# Altium schematic sheet SD.SchDoc
size A; DocumentNumber: 7; SheetNumber: 7; SheetTotal: 13
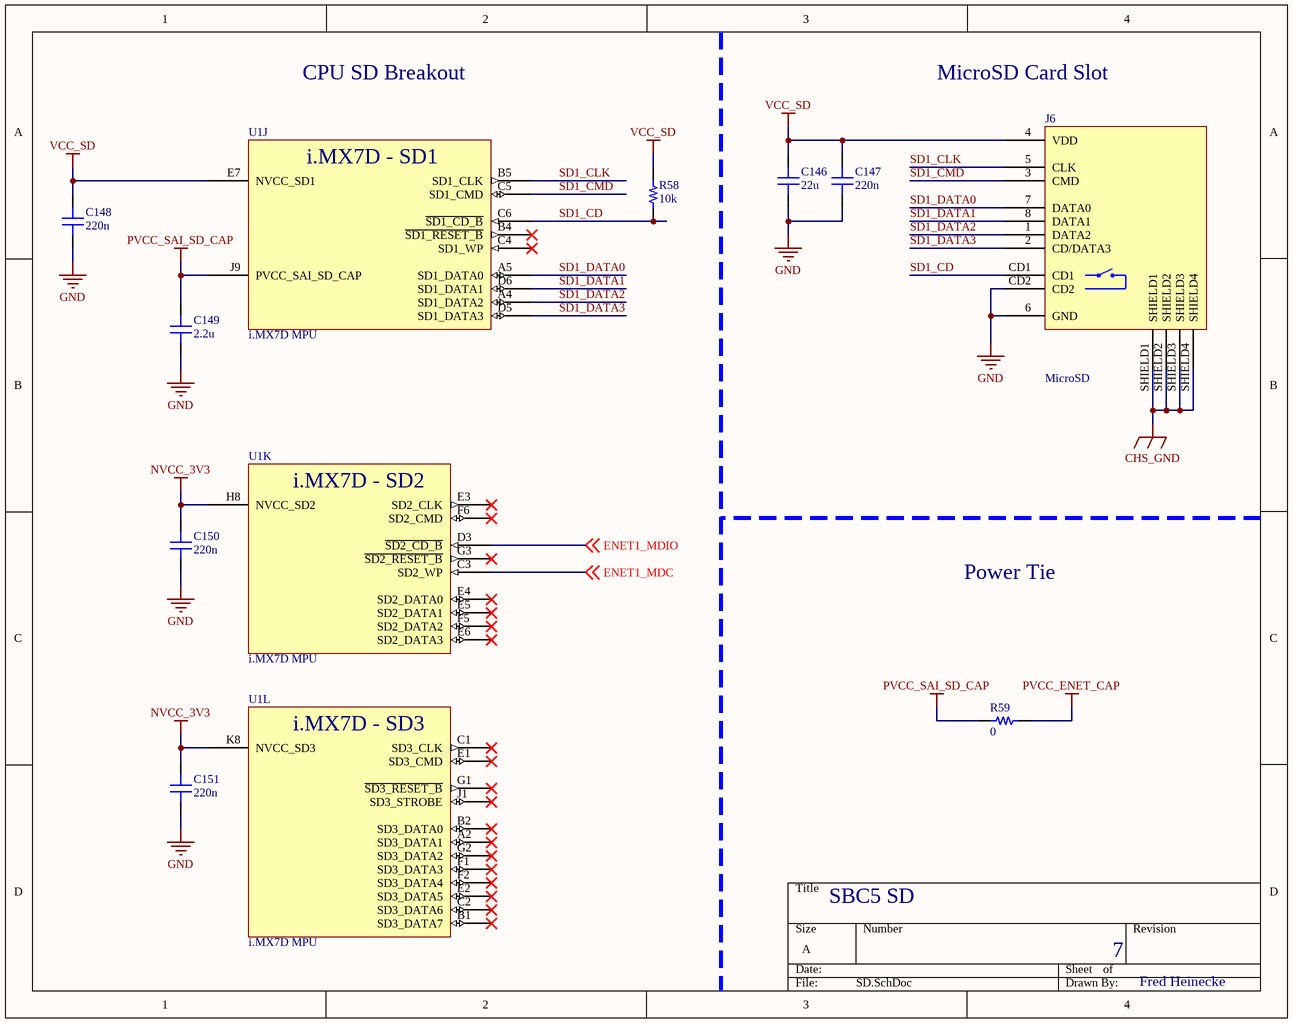
[diagram p0: SD.SchDoc]

## Parts
C146  22u  [C0603]
C147  220n  [C0201]
C148  220n  [C0201]
C149  2.2u  [C0402]
C150  220n  [C0201]
C151  220n  [C0201]
J6  MicroSD  [114-00841-68]
R58  10k  [R0201]
R59  0  [R0402]
U1  i.MX7D MPU  [BGA541C75P25X25_1900X1900X140]  (parts J,K,L of 23)

## Nets
CHS_GND: J6.SHIELD1 J6.SHIELD2 J6.SHIELD3 J6.SHIELD4
GND: C146.1 C147.1 C148.1 C149.1 C150.1 C151.1 J6.6(GND) J6.CD2
NVCC_3V3: C150.2 C151.2 U1.H8(NVCC_SD2) U1.K8(NVCC_SD3)
PVCC_ENET_CAP: R59.2
PVCC_SAI_SD_CAP: C149.2 R59.1 U1.J9(PVCC_SAI_SD_CAP)
VCC_SD: C146.2 C147.2 C148.2 J6.4(VDD) R58.2 U1.E7(NVCC_SD1)
ENET1_MDC: U1.C3(SD2_WP) ; off-sheet ENET1_MDC
ENET1_MDIO: U1.D3(~{SD2_CD_B}) ; off-sheet ENET1_MDIO
SD1_CD: J6.CD1 R58.1 U1.C6(~{SD1_CD_B})
SD1_CLK: J6.5(CLK) U1.B5(SD1_CLK)
SD1_CMD: J6.3(CMD) U1.C5(SD1_CMD)
SD1_DATA0: J6.7(DATA0) U1.A5(SD1_DATA0)
SD1_DATA1: J6.8(DATA1) U1.D6(SD1_DATA1)
SD1_DATA2: J6.1(DATA2) U1.A4(SD1_DATA2)
SD1_DATA3: J6.2(CD/DATA3) U1.D5(SD1_DATA3)

Not connected (* = marked no-connect by the designer): U1 A2(SD3_DATA1)* B1(SD3_DATA7)* B2(SD3_DATA0)* B4(~{SD1_RESET_B})* C1(SD3_CLK)* C2(SD3_DATA6)* C4(SD1_WP)* E1(SD3_CMD)* E2(SD3_DATA5)* E3(SD2_CLK)* E4(SD2_DATA0)* E5(SD2_DATA1)* E6(SD2_DATA3)* F1(SD3_DATA3)* F2(SD3_DATA4)* F5(SD2_DATA2)* F6(SD2_CMD)* G1(~{SD3_RESET_B})* G2(SD3_DATA2)* G3(~{SD2_RESET_B})* J1(SD3_STROBE)*

## Notes on the sheet
- CPU SD Breakout
- MicroSD Card Slot
- Power Tie
- SBC5 SD
- 7
- Fred Heinecke
- (in symbol MCIMX7D2DVM12SD, part J) i.MX7D - SD1
- (in symbol MCIMX7D2DVM12SD, part K) i.MX7D - SD2
- (in symbol MCIMX7D2DVM12SD, part L) i.MX7D - SD3

## Library data of the parts
C146 = GRM188R61A226ME15D: 0603 22 uF 10 V ±20% Tolerance X5R Multilayer Ceramic Chip Capacitor; Manufacturer: Murata; Capacitance: 22uF; Voltage Rating: 10V; Supplier 1: Digi-Key; Manufacturer Part Number: GRM188R61A226ME15D; RoHS: Yes; Category: Ceramic Capacitors; Stock 1: 1418007; Pricing 1: 1=0.30000, 10=0.20500, 50=0.13680, 100=0.11630, 500=0.08210, 1000=0.07184 (USD); Mount: Surface Mount; Case/Package: 0603; Case Code (Metric): 1608; Case Code (Imperial): 0603; Material: Ceramic; Weight: 0.000222oz; Min Operating Temperature: -55°C; Max Operating Temperature: 85°C; Tolerance: 20%; Packaging: Tape and Reel; Dielectric: X5R; Termination: SMD/SMT; Voltage Rating (DC): 10V; Package Quantity: 4000; Length: 1.6mm; Width: 0.8mm; Height: 0.8mm; Thickness: 0.039inch; Depth: 0.8mm; REACH SVHC: No SVHC; Lead Free: Lead Free; ComponentLink1URL: https://datasheet.ciiva.com/46444/1769893-46444975.pdf?src-supplier=Element14; ComponentLink1Description: https://datasheet.ciiva.com/46444/1769893-46444975.pdf?src-supplier=Element14; Supplier Part Number 1: 490-10476-1-ND
C147 C148 C150 C151 = GRM033R61C224KE14D: Cap Ceramic Monolithic 0.22uF 16VDC 10% SMD Paper T/R; Manufacturer: Murata; Supplier 1: Digi-Key; Manufacturer Part Number: GRM033R61C224KE14D; RoHS: No; Stock 1: 16192; Pricing 1: 1=0.10000, 10=0.03900, 50=0.02120, 100=0.01720, 500=0.01232, 1000=0.00968, 2500=0.00880, 5000=0.00810 (USD); ComponentLink1URL: https://search.murata.co.jp/Ceramy/image/img/A01X/G101/ENG/GRM033R61C224KE14-01.pdf?src-supplier=Digi-Key; ComponentLink1Description: https://search.murata.co.jp/Ceramy/image/img/A01X/G101/ENG/GRM033R61C224KE14-01.pdf?src-supplier=Digi-Key; Supplier Part Number 1: 490-17040-1-ND
C149 = LMK105BJ225MV-F: TAIYO YUDEN         LMK105BJ225MV-F            CERAMIC CAPACITOR, 2.2UF, 10V, X5R, 20%, 0402; Supplier 1: Digi-Key; Manufacturer: Taiyo Yuden; Manufacturer Part Number: LMK105BJ225MV-F; RoHS: Yes; Category: Ceramic Capacitors; Stock 1: 422093; Pricing 1: 1=0.10000, 10=0.05800, 50=0.03160, 100=0.02590, 500=0.01848, 1000=0.01452, 2500=0.01320, 5000=0.01214 (USD); Mount: Surface Mount; Case/Package: 0402; Case Code (Imperial): 0402; Case Code (Metric): 1005; Min Operating Temperature: -55°C; Max Operating Temperature: 85°C; Termination: SMD/SMT; Packaging: Tape and Reel; Capacitance: 2.2uF; Tolerance: 20%; Voltage Rating: 10V; Package Quantity: 1; Voltage Rating (DC): 10V; Dielectric: X5R; Resistor Type: Ceramic; Length: 1mm; Width: 0.5mm; Height: 0.5mm; Thickness: 0.022inch; Depth: 0.5mm; Radiation Hardening: No; Halogen Free: Halogen Free; REACH SVHC: Unknown; ComponentLink1URL: https://datasheet.ciiva.com/30190/500lmk105bj225mv-f-30190498.pdf?src-supplier=Onlinecomponents.com; ComponentLink1Description: https://datasheet.ciiva.com/30190/500lmk105bj225mv-f-30190498.pdf?src-supplier=Onlinecomponents.com; ComponentLink2URL: https://datasheet.ciiva.com/23631/lmk105bj225mv-f-ss-23631491.pdf?src-supplier=Newark; ComponentLink2Description: https://datasheet.ciiva.com/23631/lmk105bj225mv-f-ss-23631491.pdf?src-supplier=Newark; ComponentLink3URL: https://datasheet.ciiva.com/134/lmk105bj225mv-f-ss-134677.pdf?src-supplier=Digi-Key; ComponentLink3Description: https://datasheet.ciiva.com/134/lmk105bj225mv-f-ss-134677.pdf?src-supplier=Digi-Key; ComponentLink4URL: https://datasheet.ciiva.com/15921/286lmk105bj225mv-f-15921222.pdf?src-supplier=Onlinecomponents.com; ComponentLink4Description: https://datasheet.ciiva.com/15921/286lmk105bj225mv-f-15921222.pdf?src-supplier=Onlinecomponents.com; Supplier Part Number 1: 587-3153-1-ND
J6 = 1140084168: Conn; IC Socket; Micro SD; Right Angle; PCB Mount; MicroSD Ser.; Manufacturer: Amphenol Commercial; Connector Type: Connector; Number of Contacts: 8; Gender: Receptacle; Pitch: 1.1mm; Supplier 1: Digi-Key; Supplier Part Number 1: 114-00841-68-1-ND; Manufacturer Part Number: 1140084168; RoHS: Yes; Category: Memory Connectors; Stock 1: 15252; Pricing 1: 1=1.26000, 10=1.14000, 25=1.07000, 50=1.02360, 100=0.97710, 250=0.88408, 500=0.81428 (USD); Mount: Surface Mount; Contact Plating: Gold; Housing Material: Polymer; Contact Material: Copper Alloy,Copper; Packaging: Tape and Reel; Orientation: Right Angle; Package Quantity: 7500; Number of Rows: 1; Termination: SMD/SMT; Length: 15.6mm; Height: 1.55mm; Depth: 11.45mm; Radiation Hardening: No; REACH SVHC: Unknown; Flammability Rating: UL94 V-0; Lead Free: Lead Free; ComponentLink1URL: https://datasheet.ciiva.com/24241/11400841-283410-24241569.pdf?src-supplier=Mouser; ComponentLink1Description: https://datasheet.ciiva.com/24241/11400841-283410-24241569.pdf?src-supplier=Mouser; ComponentLink2URL: https://datasheet.ciiva.com/28408/11400841-28408193.pdf?src-supplier=Element14; ComponentLink2Description: https://datasheet.ciiva.com/28408/11400841-28408193.pdf?src-supplier=Element14; ComponentLink3URL: https://datasheet.ciiva.com/9464/1140084168-9464901.pdf?src-supplier=Avnet; ComponentLink3Description: https://datasheet.ciiva.com/9464/1140084168-9464901.pdf?src-supplier=Avnet; ComponentLink4URL: https://datasheet.ciiva.com/48965/70323450-48965706.pdf?src-supplier=Allied+Electronics; ComponentLink4Description: https://datasheet.ciiva.com/48965/70323450-48965706.pdf?src-supplier=Allied+Electronics; ComponentLink5URL: https://datasheet.ciiva.com/16655/1140084168-16655293.pdf?src-supplier=Avnet+Europe; ComponentLink5Description: https://datasheet.ciiva.com/16655/1140084168-16655293.pdf?src-supplier=Avnet+Europe
R58 = RMCF0201FT10K0: RES 10K OHM 1% 1/20W 0201; Manufacturer: Stackpole Electronics; Max Power Dissipation: 50mW; Temperature Coefficient: 200ppm/°C; Resistance: 10kR; Supplier 1: Digi-Key; Manufacturer Part Number: RMCF0201FT10K0; RoHS: Yes; Category: Chip SMD Resistors; Stock 1: 1526173; Pricing 1: 1=0.10000, 10=0.02300, 100=0.00940, 1000=0.00424, 2500=0.00368, 5000=0.00304 (USD); Mount: Surface Mount; Case/Package: 0201; Contact Plating: Tin,Matte; Case Code (Imperial): 0201; Case Code (Metric): 0603; Min Operating Temperature: -55°C; Max Operating Temperature: 125°C; Resistor Type: Thick Film; Number of Terminations: 2; Packaging: Tape and Reel; Tolerance: 1%; Power Rating: 50mW; Length: 0.024inch; Width: 0.012inch; Height: 0.009inch; ComponentLink1URL: https://www.seielect.com/catalog/SEI-Packaging.pdf?src-supplier=Digi-Key; ComponentLink1Description: https://www.seielect.com/catalog/SEI-Packaging.pdf?src-supplier=Digi-Key; ComponentLink2URL: https://www.seielect.com/Catalog/SEI-RMCF_RMCP.pdf?src-supplier=Avnet+Asia; ComponentLink2Description: https://www.seielect.com/Catalog/SEI-RMCF_RMCP.pdf?src-supplier=Avnet+Asia; ComponentLink3URL: https://www.seielect.com/Catalog/SEI-RMCF_RMCP.pdf?src-supplier=Avnet; ComponentLink3Description: https://www.seielect.com/Catalog/SEI-RMCF_RMCP.pdf?src-supplier=Avnet; ComponentLink4URL: https://www.seielect.com/Catalog/SEI-RMCF_RMCP.pdf?src-supplier=Digi-Key; ComponentLink4Description: https://www.seielect.com/Catalog/SEI-RMCF_RMCP.pdf?src-supplier=Digi-Key; Supplier Part Number 1: RMCF0201FT10K0CT-ND
R59 = RMCF0402ZT0R00: RES 0 OHM JUMPER 1/16W 0402; Manufacturer: Stackpole Electronics; Resistance: 0R; Power Rating: 63mW; Current Rating: 1A; Working Voltage: 50V; Supplier 1: Digi-Key; Supplier Part Number 1: RMCF0402ZT0R00CT-ND; Manufacturer Part Number: RMCF0402ZT0R00; RoHS: Yes; Category: Chip SMD Resistors; Stock 1: 7645981; Pricing 1: 1=0.10000, 10=0.01000, 25=0.00720, 50=0.00560, 100=0.00410, 250=0.00316, 500=0.00252, 1000=0.00186, 5000=0.00133 (USD); Mount: Surface Mount; Case/Package: 0402; Case Code (Metric): 1005; Case Code (Imperial): 0402; Contact Plating: Tin,Matte; Min Operating Temperature: -55°C; Max Operating Temperature: 155°C; Packaging: Tape and Reel; Resistor Type: Thick Film; Number of Terminations: 2; Max Power Dissipation: 63mW; Features: Automotive AEC-Q200; Series: RMCF; Technology: THICK FILM; Construction: Rectangular; Length: 0.039inch; Width: 0.02inch; Height: 0.016inch; Depth: 0.5mm; Radiation Hardening: No; Military Standard: Not; Lead Free: Lead Free; RoHS Compliant: Yes; ComponentLink1URL: https://datasheet.ciiva.com/26835/getdatasheetpartid-409751-26835612.pdf?src-supplier=Verical; ComponentLink1Description: https://datasheet.ciiva.com/26835/getdatasheetpartid-409751-26835612.pdf?src-supplier=Verical
U1 = MCIMX7D2DVM12SD: Heterogeneous Multicore Processing Architecture; Manufacturer: NXP Freescale; Manufacturer Part Number: MCIMX7D2DVM12SD; Stock 1: 0; Pricing 1: 168=18.42238 (USD); ComponentLink1Description: Datasheet; ComponentLink1URL: https://www.nxp.com/docs/en/data-sheet/IMX7DCEC.pdf; ComponentLink2Description: Reference manual; ComponentLink2URL: https://www.nxp.com/docs/en/reference-manual/IMX7DRM.pdf; ComponentLink3Description: Hardware Development Guide; ComponentLink3URL: https://www.nxp.com/docs/en/user-guide/IMX7DSHDG.pdf; Supplier 1: Digi-Key; Supplier Part Number 1: 568-15401-ND